# EAGLE design Schatten6 (EAGLE 6.5.0)
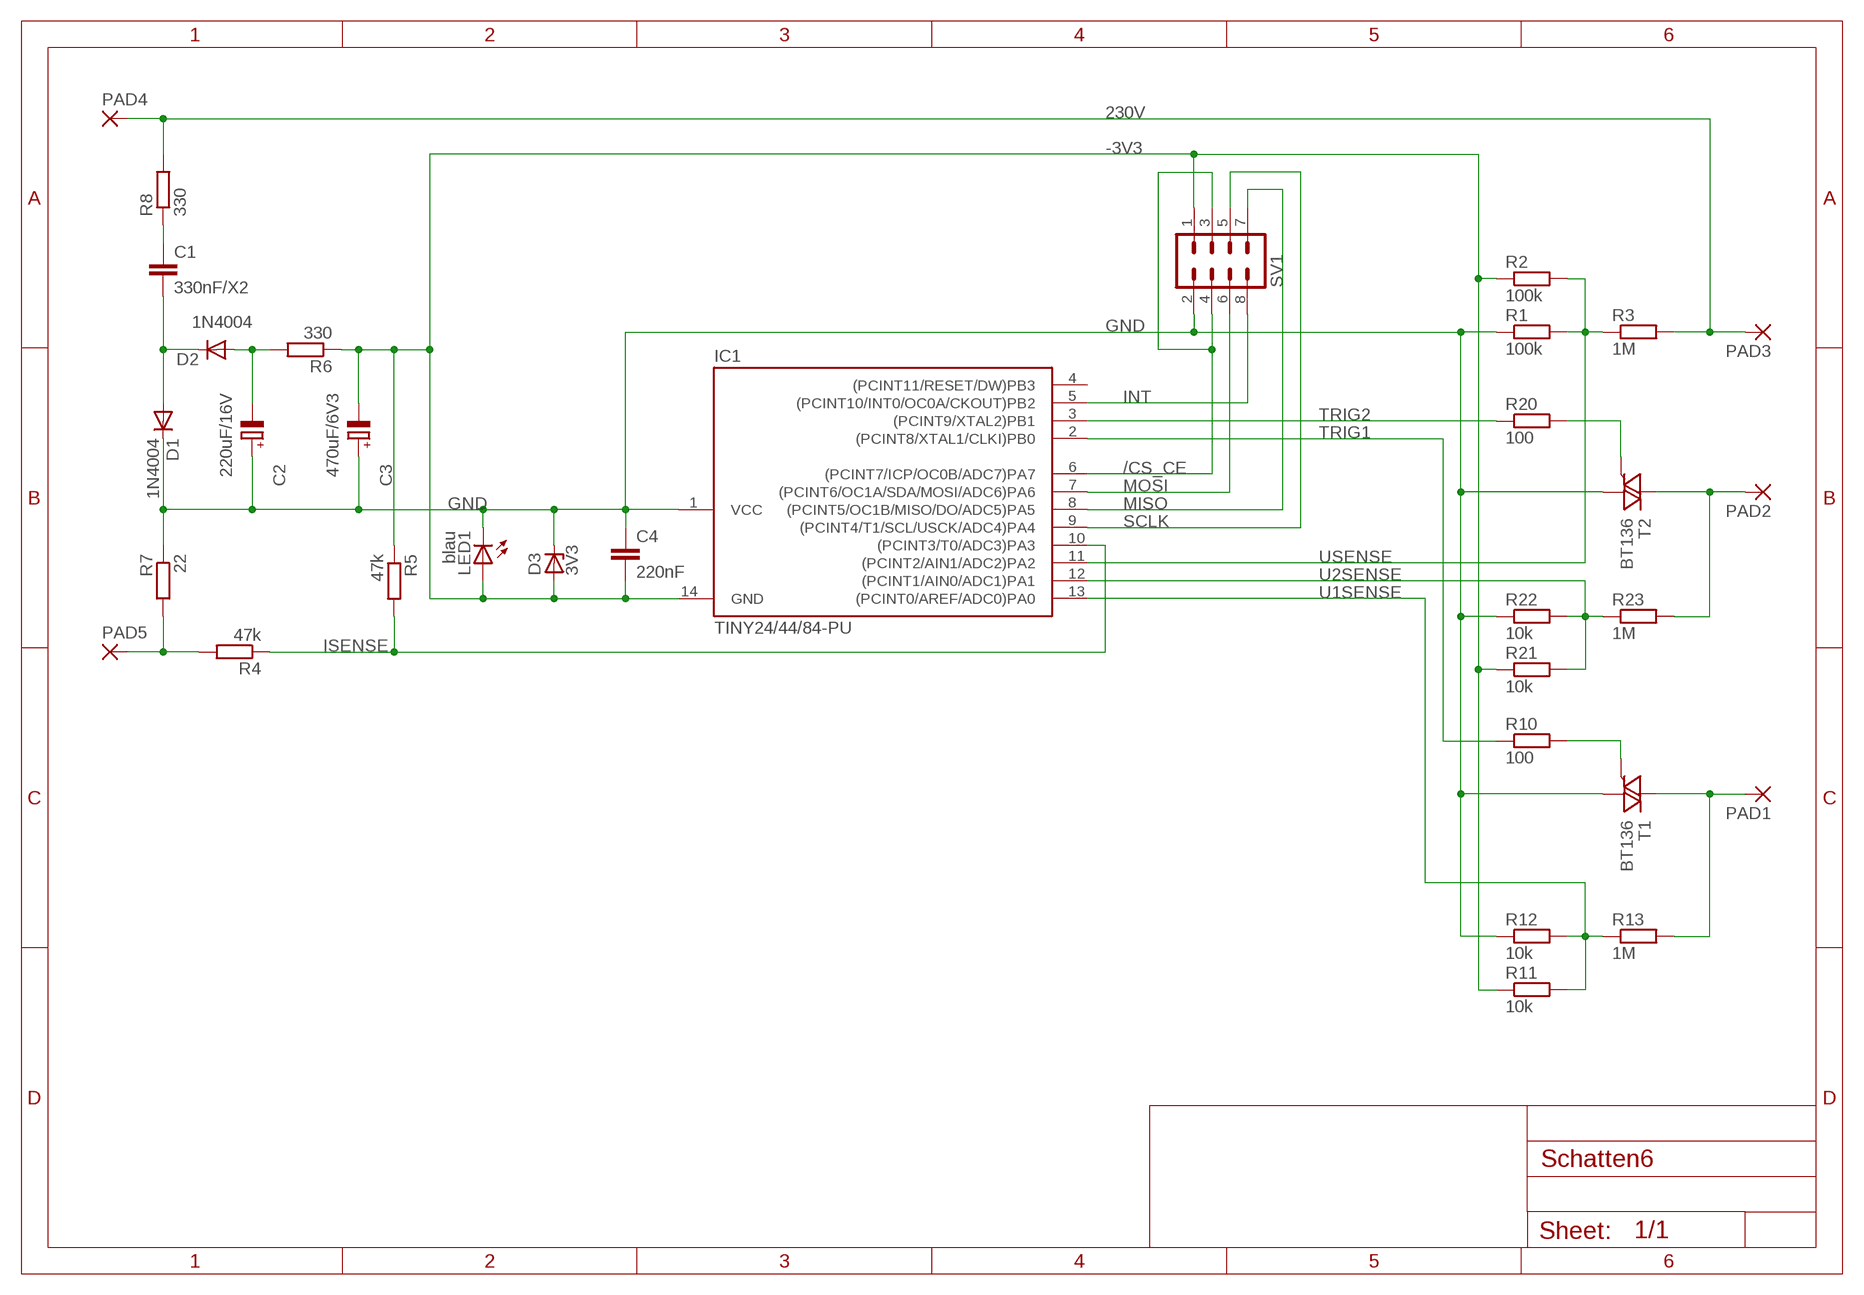
[diagram p0: schematic, sheet 1]

## Parts
C1  330nF/X2  C-EU150-064X183  [C150-064X183]
C2  220uF/16V  CPOL-EUE5-8.5  [E5-8,5]
C3  470uF/6V3  CPOL-EUE5-8.5  [E5-8,5]
C4  220nF  C-EUC3225  [C3225]
D1  1N4004  [DO41-10]
D2  1N4004  [DO41-10]
D3  3V3  ZENER-DIODEZD-7.5  [ZDIO-7.5]
IC1  TINY24/44/84-PU  [DIL14]
LED1  blau  LED3MM  [LED3MM]
PAD1  1,6/0,9  [1,6/0,9]
PAD2  1,6/0,9  [1,6/0,9]
PAD3  1,6/0,9  [1,6/0,9]
PAD4  1,6/0,9  [1,6/0,9]
PAD5  1,6/0,9  [1,6/0,9]
R1  100k  R-EU_0207/10  [0207/10]
R2  100k  R-EU_0207/10  [0207/10]
R3  1M  R-EU_0207/10  [0207/10]
R4  47k  R-EU_0207/10  [0207/10]
R5  47k  R-EU_0204/2V  [0204V]
R6  330  R-EU_0207/10  [0207/10]
R7  22  R-EU_0207/10  [0207/10]
R8  330  R-EU_0207/10  [0207/10]
R10  100  R-EU_0207/10  [0207/10]
R11  10k  R-EU_0204/7  [0204/7]
R12  10k  R-EU_0207/10  [0207/10]
R13  1M  R-EU_0207/10  [0207/10]
R20  100  R-EU_0207/10  [0207/10]
R21  10k  R-EU_0207/10  [0207/10]
R22  10k  R-EU_0207/10  [0207/10]
R23  1M  R-EU_0207/10  [0207/10]
SV1  MA04-2  [MA04-2]
T1  BT136  [TO220AB]
T2  BT136  [TO220AB]

## Nets
230V: PAD3.1(P) PAD4.1(P) R3.2 R8.2
-3V3: C3.- C4.2 D3.A IC1.14(GND) LED1.A R2.1 R5.1 R6.1 R11.1 R21.1 SV1.1
/CS_CE: IC1.6((PCINT7/ICP/OC0B/ADC7)PA7) SV1.3 SV1.4
GND: C2.+ C3.+ C4.1 D1.C D3.C IC1.1(VCC) LED1.K(C) R1.1 R7.1 R12.1 R22.1 SV1.2 T1.1(A1) T2.1(A1)
INT: IC1.5((PCINT10/INT0/OC0A/CKOUT)PB2) SV1.8
ISENSE: IC1.10((PCINT3/T0/ADC3)PA3) R4.1 R5.2
MISO: IC1.8((PCINT5/OC1B/MISO/DO/ADC5)PA5) SV1.7
MOSI: IC1.7((PCINT6/OC1A/SDA/MOSI/ADC6)PA6) SV1.6
N$1: PAD5.1(P) R4.2 R7.2
N$7: PAD1.1(P) R13.2 T1.2(A2)
N$8: PAD2.1(P) R23.2 T2.2(A2)
N$11: R20.2 T2.3(G)
N$12: R10.2 T1.3(G)
N$19: C1.1 R8.1
N$20: C1.2 D1.A D2.C
N$21: C2.- D2.A R6.2
SCLK: IC1.9((PCINT4/T1/SCL/USCK/ADC4)PA4) SV1.5
TRIG1: IC1.2((PCINT8/XTAL1/CLKI)PB0) R10.1
TRIG2: IC1.3((PCINT9/XTAL2)PB1) R20.1
U1SENSE: IC1.13((PCINT0/AREF/ADC0)PA0) R11.2 R12.2 R13.1
U2SENSE: IC1.12((PCINT1/AIN0/ADC1)PA1) R21.2 R22.2 R23.1
USENSE: IC1.11((PCINT2/AIN1/ADC2)PA2) R1.2 R2.2 R3.1
Unconnected: IC1.4((PCINT11/RESET/DW)PB3)

## Library data of the parts
C1 C4 = rcl:C-EU: CAPACITOR, European symbol
C2 C3 = rcl:CPOL-EU: POLARIZED CAPACITOR, European symbol
D1 D2 = diode:1N4004: DIODE general purpose rectifier, 1 A
D3 = diode:ZENER-DIODE: Z-Diode
IC1 = avr-5-4.16:TINY24/44/84
LED1 = led:LED: LED OSRAM: - CHIPLED LG R971, LG N971, LY N971, LG Q971, LY Q971, LO R971, LY R971 LH N974, LH R974 LS Q976, LO Q976, LY Q976 LO Q996 - Hyper CHIPLED LW Q18S LB Q993, LB Q99A, LB R99A - SideLED LS A670, LO A670, LY A670, LG A670, LP A670 LB A673, LV A673, LT A673, LW A673 LH A674 LY A675 LS A676, LA A676, LO A676, LY A676, LW A676 LS A679, LY A679, LG A679 - Hyper Micro SIDELED® LS Y876, LA Y876, LO Y876, LY Y876 LT Y87S - SmartLED LW L88C, LW L88S LB L89C, LB L89S, LG L890 LS L89K, LO L89K, LY L89K LS L896, LA L896, LO L896, LY L896 - TOPLED LS T670, LO T670, LY T670, LG T670, LP T670 LSG T670, LSP T670, LSY T670, LOP T670, LYG T670 LG T671, LOG T671, LSG T671 LB T673, LV T673, LT T673, LW T673 LH T674 LS T676, LA T676, LO T676, LY T676, LB T676, LH T676, LSB T676, LW T676 LB T67C, LV T67C, LT T67C, LS T67K, LO T67K, LY T67K, LW E67C LS E67B, LA E67B, LO E67B, LY E67B, LB E67C, LV E67C, LT E67C LW T67C LS T679, LY T679, LG T679 LS T770, LO T770, LY T770, LG T770, LP T770 LB T773, LV T773, LT T773, LW T773 LH T774 LS E675, LA E675, LY E675, LS T675 LS T776, LA T776, LO T776, LY T776, LB T776 LHGB T686 LT T68C, LB T68C - Hyper Mini TOPLED® LB M676 - Mini TOPLED Santana® LG M470 LS M47K, LO M47K, LY M47K Source: http://www.osram.convergy.de LUXEON: - LUMILED® LXK2-PW12-R00, LXK2-PW12-S00, LXK2-PW14-U00, LXK2-PW14-V00 LXK2-PM12-R00, LXK2-PM12-S00, LXK2-PM14-U00 LXK2-PE12-Q00, LXK2-PE12-R00, LXK2-PE12-S00, LXK2-PE14-T00, LXK2-PE14-U00 LXK2-PB12-K00, LXK2-PB12-L00, LXK2-PB12-M00, LXK2-PB14-N00, LXK2-PB14-P00, LXK2-PB14-Q00 LXK2-PR12-L00, LXK2-PR12-M00, LXK2-PR14-Q00, LXK2-PR14-R00 LXK2-PD12-Q00, LXK2-PD12-R00, LXK2-PD12-S00 LXK2-PH12-R00, LXK2-PH12-S00 LXK2-PL12-P00, LXK2-PL12-Q00, LXK2-PL12-R00 Source: www.luxeon.com KINGBRIGHT: KA-3528ASYC Source: www.kingbright.com
PAD1-PAD5 = wirepad:1,6/0,9: THROUGH-HOLE PAD
R1-R8 R10-R13 R20-R23 = rcl:R-EU_: RESISTOR, European symbol
SV1 = con-lstb:MA04-2: PIN HEADER; OC_FARNELL: unknown; OC_NEWARK: unknown
T1 T2 = triac:BT136: Triac BT136 series E sensitive gate Source: http://www.nxp.com/acrobat_download/datasheets/BT136_SERIES_E_2.pdf

## Board
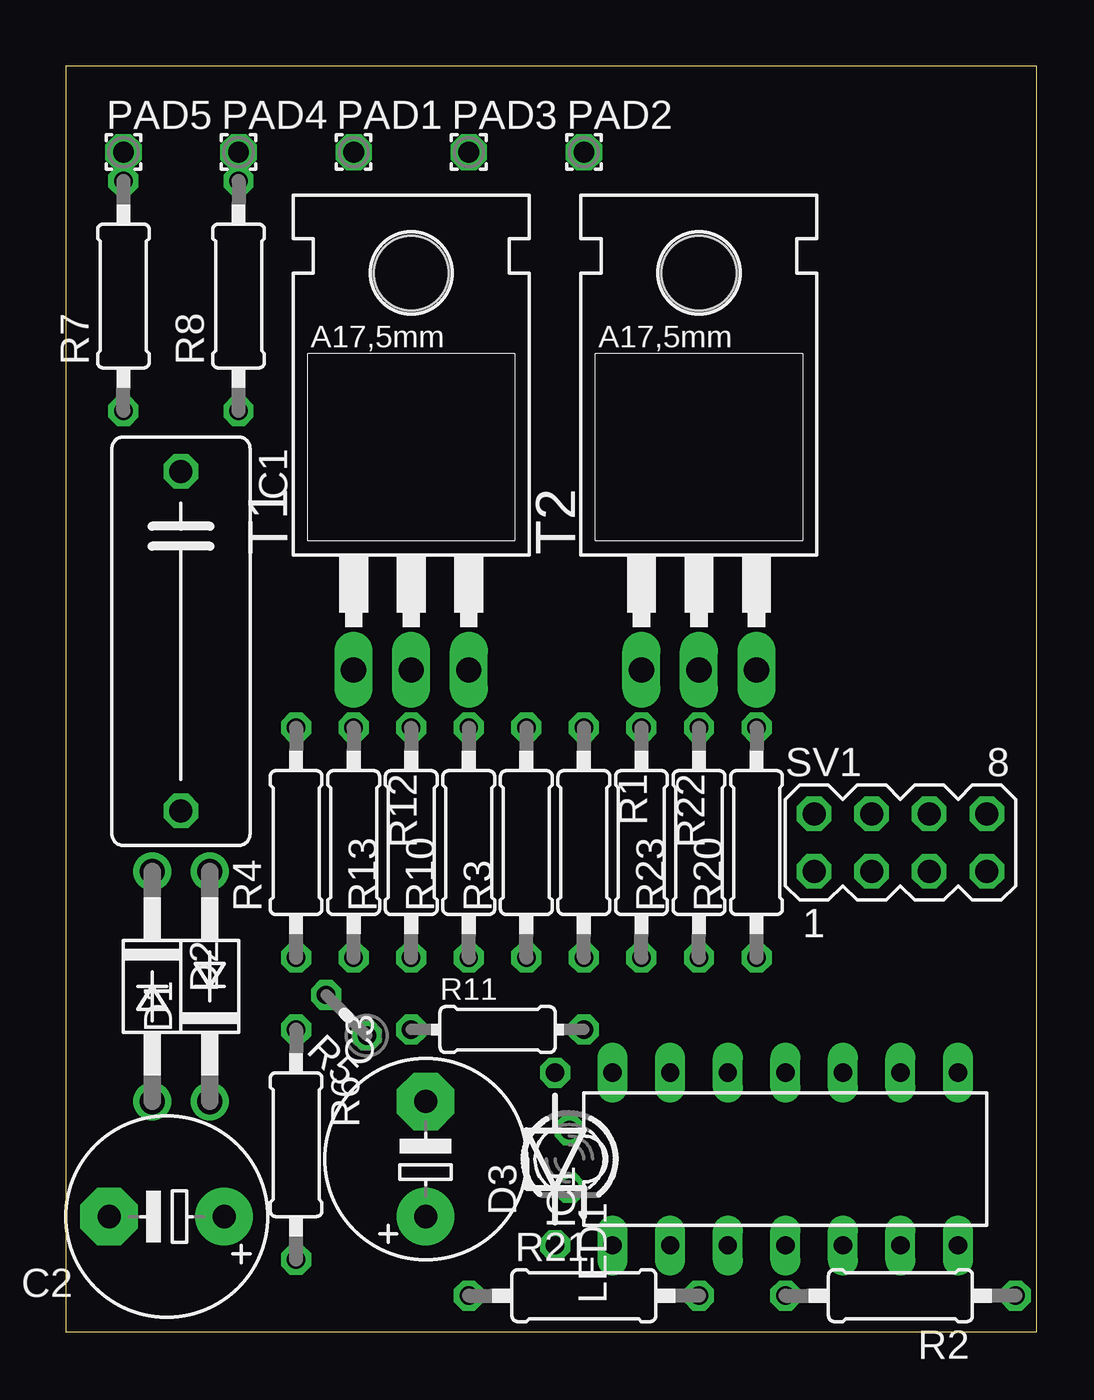
[diagram p1: board, top side]
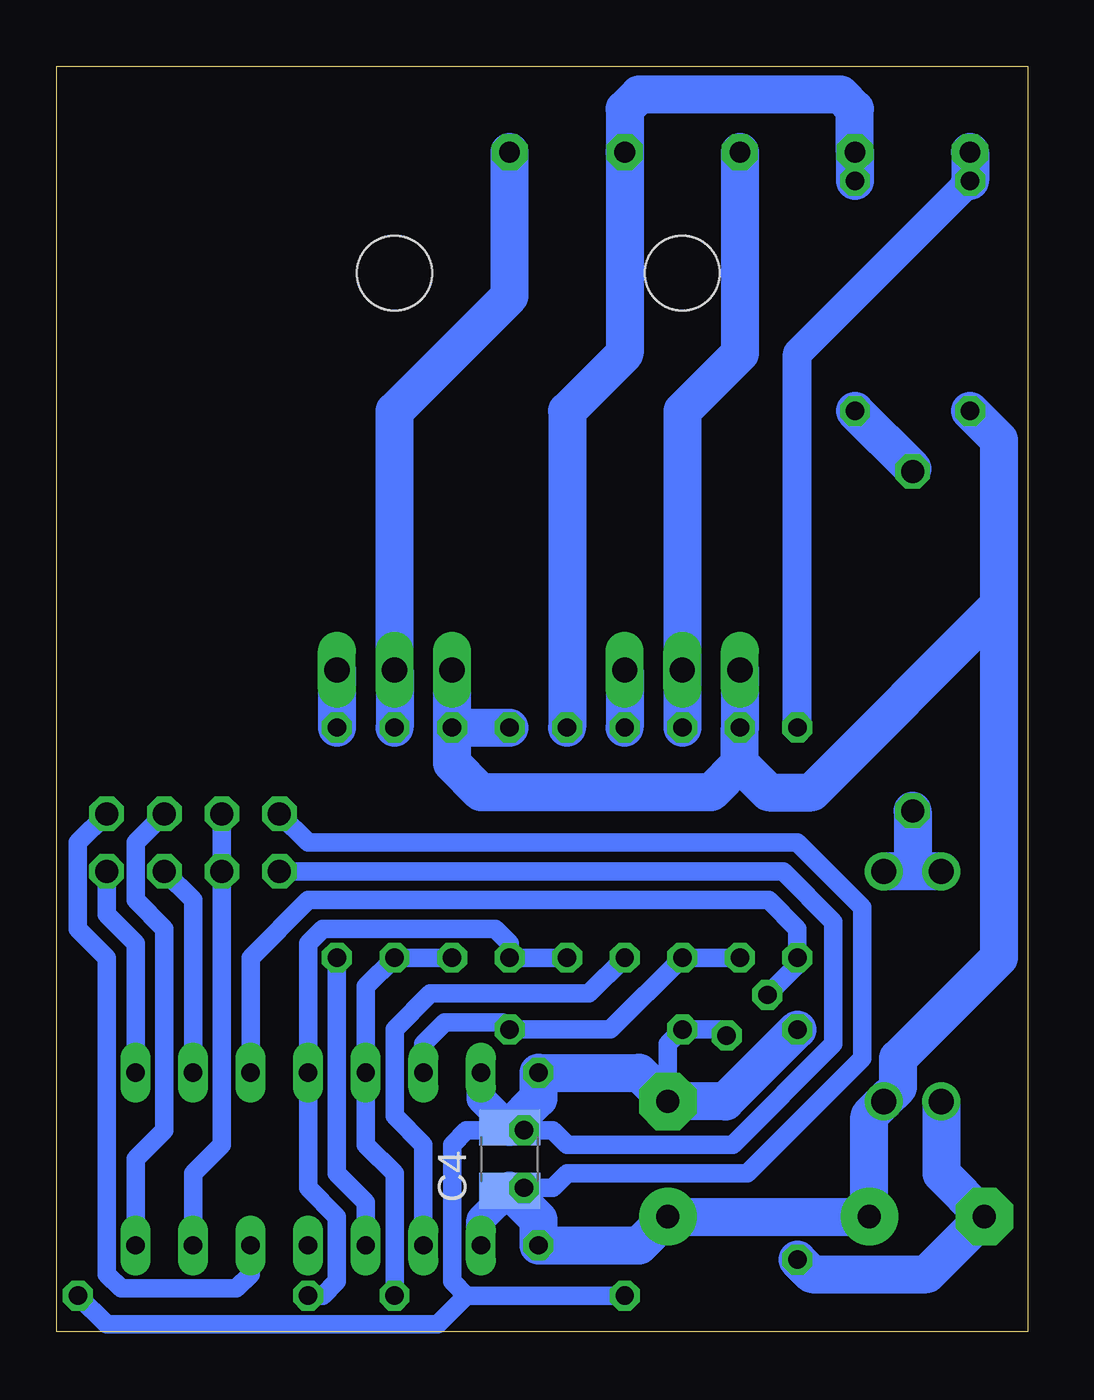
[diagram p2: board, bottom side, seen from below]

Size 42.85 x 55.87 mm. Coordinates in mm from the lower left corner, seen from the top.
Outline: 0,0 42.85,0 42.85,55.87 0,55.87 0,0
Copper layers (1*16): Top 0.035mm / dielectric 1.5mm / Bottom 0.035mm
Design rules "default": minimum track width 10mil, minimum drill 0.6mm, track to track 8mil, track to pad 8mil, pad to pad 8mil, via to via 8mil, smd to smd 8mil, copper to edge 40mil, drill to drill 8mil, minimum pad ring 10mil, minimum via ring 8mil, stop-mask expansion 4mil, vias tented up to drill 0mil, thermal gap 10mil

### Footprints (pad centres in the part's own frame; a part is rotated, then mirrored left to right if it is on the bottom)
C150-064X183 = drill 1.016 octagon: 1 -7.493,0; 2 7.493,0
E5-8,5 = drill 1.016 pad 2.54: + -2.54,0 | drill 1.016 pad 2.54 octagon: - 2.54,0
C3225 = smd 1.6 x 2.7: 1 -1.4,0; 2 1.4,0
DO41-10 = drill 1.118: A 5.08,0; C -5.08,0
ZDIO-7.5 = drill 0.813 octagon: A 3.81,0; C -3.81,0
DIL14 = drill 0.813 long: 1 -7.62,-3.81; 2 -5.08,-3.81; 3 -2.54,-3.81; 4 0,-3.81; 5 2.54,-3.81; 6 5.08,-3.81; 7 7.62,-3.81; 8 7.62,3.81; 9 5.08,3.81; 10 2.54,3.81; 11 0,3.81; 12 -2.54,3.81; 13 -5.08,3.81; 14 -7.62,3.81
LED3MM = drill 0.813 octagon: A -1.27,0; K 1.27,0
1,6/0,9 = drill 0.914 pad 1.6 octagon: 1 0,0
0207/10 = drill 0.813 octagon: 1 -5.08,0; 2 5.08,0
0204V = drill 0.813 octagon: 1 -1.27,0; 2 1.27,0
0204/7 = drill 0.813 octagon: 1 -3.81,0; 2 3.81,0
MA04-2 = drill 1.016 octagon: 1 -3.81,-1.27; 2 -3.81,1.27; 3 -1.27,-1.27; 4 -1.27,1.27; 5 1.27,-1.27; 6 1.27,1.27; 7 3.81,-1.27; 8 3.81,1.27
TO220AB = drill 1.118 long: 1 -2.54,-6.35; 2 0,-6.35; 3 2.54,-6.35 | hole 3.302: 0,11.176

### Placement (x,y rotation side)
C1  5.08,30.48 270 top
C2  4.45,5.08 180 top
C3  15.88,7.62 90 top
C4  22.86,7.62 90 bottom
D1  6.35,15.24 90 top
D2  3.81,15.24 270 top
D3  21.59,7.62 90 top
IC1  31.75,7.62 0 top
LED1  22.23,7.62 270 top
PAD1  12.7,52.07 0 top
PAD2  22.86,52.07 0 top
PAD3  17.78,52.07 0 top
PAD4  7.62,52.07 0 top
PAD5  2.54,52.07 0 top
R1  22.86,21.59 270 top
R2  36.83,1.59 180 top
R3  20.32,21.59 90 top
R4  10.16,21.59 90 top
R5  12.38,13.97 135 top
R6  10.16,8.26 270 top
R7  2.54,45.72 90 top
R8  7.62,45.72 90 top
R10  17.78,21.59 90 top
R11  19.05,13.34 0 top
R12  12.7,21.59 270 top
R13  15.24,21.59 90 top
R20  30.48,21.59 90 top
R21  22.86,1.59 0 top
R22  25.4,21.59 270 top
R23  27.94,21.59 90 top
SV1  36.83,21.59 0 top
T1  15.24,35.56 0 top
T2  27.94,35.56 0 top

### Tracks (layer width: path | path; a pad name or v marks a point on that pad's centre or on a via)
230V
  Bottom 1.676: R3.2 20.32,40.64 17.78,43.18 PAD3.1 17.78,53.98 17.14,54.61 8.26,54.61 7.62,53.98 PAD4.1 R8.2
-3V3
  Bottom 0.406: LED1.A 22.86,8.89 C4.2
  Bottom 0.813: SV1.1 10.79,20.32 8.57,18.1 8.57,12.7 13.02,8.26 20.32,8.26 20.95,8.89 LED1.A 22.73,8.89 C4.2 22.99,8.89 24.77,8.89 25.4,8.26 25.4,2.22 24.77,1.59 | R21.1 24.77,1.59 | R2.1 40.64,0.32 26.04,0.32 24.77,1.59 | R5.1 13.54,13.34 R11.1 15.88,12.7 C3.-
  Bottom 1.27: IC1.14 24.13,10.29 C4.2
  Bottom 1.676: C4.2 21.59,10.29 D3.A 17.14,11.43 C3.- 13.34,10.16 R6.1
/CS_CE
  Bottom 0.813: IC1.6 36.83,6.99 35.56,8.26 SV1.3 SV1.4
GND
  Bottom 0.406: LED1.K 22.86,6.35 C4.1
  Bottom 0.813: C4.1 22.73,6.35 LED1.K 20.95,6.35 20.32,6.99 12.38,6.99 7.3,12.06 7.3,18.73 10.16,21.59 31.75,21.59 SV1.2
  Bottom 1.27: IC1.1 24.13,4.95 C4.1
  Bottom 1.676: C4.1 21.59,4.95 D3.C 17.14,3.81 C3.+ C2.+ 6.99,9.53 D1.C 5.71,10.79 5.71,12.06 1.27,16.51 1.27,32.07 | T1.1 R12.1 12.7,25.08 | 12.7,25.08 13.97,23.81 24.13,23.81 25.4,25.08 R22.1 | R22.1 T2.1 | R22.1 R1.1 | 12.7,25.08 11.43,23.81 9.53,23.81 1.27,32.07 | R7.1 1.27,39.37 1.27,32.07
INT
  Bottom 0.813: SV1.8 41.91,21.59 41.91,17.78 40.64,16.51 40.64,2.54 40.01,1.91 34.92,1.91 34.29,2.54 IC1.5
ISENSE
  Bottom 0.813: IC1.10 34.29,16.51 31.75,19.05 11.43,19.05 10.16,17.78 R4.1 10.16,16.19 R5.2
MISO
  Bottom 0.813: IC1.8 39.37,17.14 40.64,18.41 SV1.7
MOSI
  Bottom 0.813: IC1.7 39.37,7.62 38.1,8.89 38.1,17.78 39.37,19.05 39.37,21.59 SV1.6
N$1
  Bottom 1.27: R4.2 10.16,43.18 R7.2
  Bottom 1.676: PAD5.1 R7.2
N$7
  Bottom 1.676: R13.2 T1.2 15.24,40.64 12.7,43.18 PAD1.1
N$8
  Bottom 1.676: R23.2 T2.2 27.94,40.64 22.86,45.72 PAD2.1
N$11
  Bottom 1.676: T2.3 R20.2
N$12
  Bottom 1.676: T1.3 R10.2
N$19
  Bottom 1.27: C1.1 5.08,38.1
  Bottom 1.676: 5.08,38.1 R8.1
N$20
  Bottom 1.676: D2.C 5.08,20.32 | 5.08,20.32 D1.A | C1.2 5.08,20.32
N$21
  Bottom 1.676: D2.A 3.81,6.99 C2.- 4.45,2.54 9.53,2.54 R6.2
SCLK
  Bottom 0.813: IC1.9 36.83,19.05 SV1.5
TRIG1
  Bottom 0.813: IC1.2 26.67,8.26 27.94,9.53 27.94,13.34 26.35,14.92 19.37,14.92 R10.1
TRIG2
  Bottom 0.813: IC1.3 29.21,5.71 30.48,6.99 R20.1
U1SENSE
  Bottom 0.813: R12.2 R13.1 18.41,13.34 R11.2 23.18,13.65 25.72,13.65 26.67,12.7 IC1.13
U2SENSE
  Bottom 0.813: R22.2 R23.1 29.21,15.24 IC1.12 29.21,8.26 27.94,6.99 R21.2
USENSE
  Bottom 0.813: R3.1 R1.2 22.86,17.14 23.5,17.78 31.11,17.78 31.75,17.14 IC1.11 31.75,6.35 30.48,5.08 30.48,2.22 31.11,1.59 R2.2